# Altium project fullCURRENT control.PrjPCB
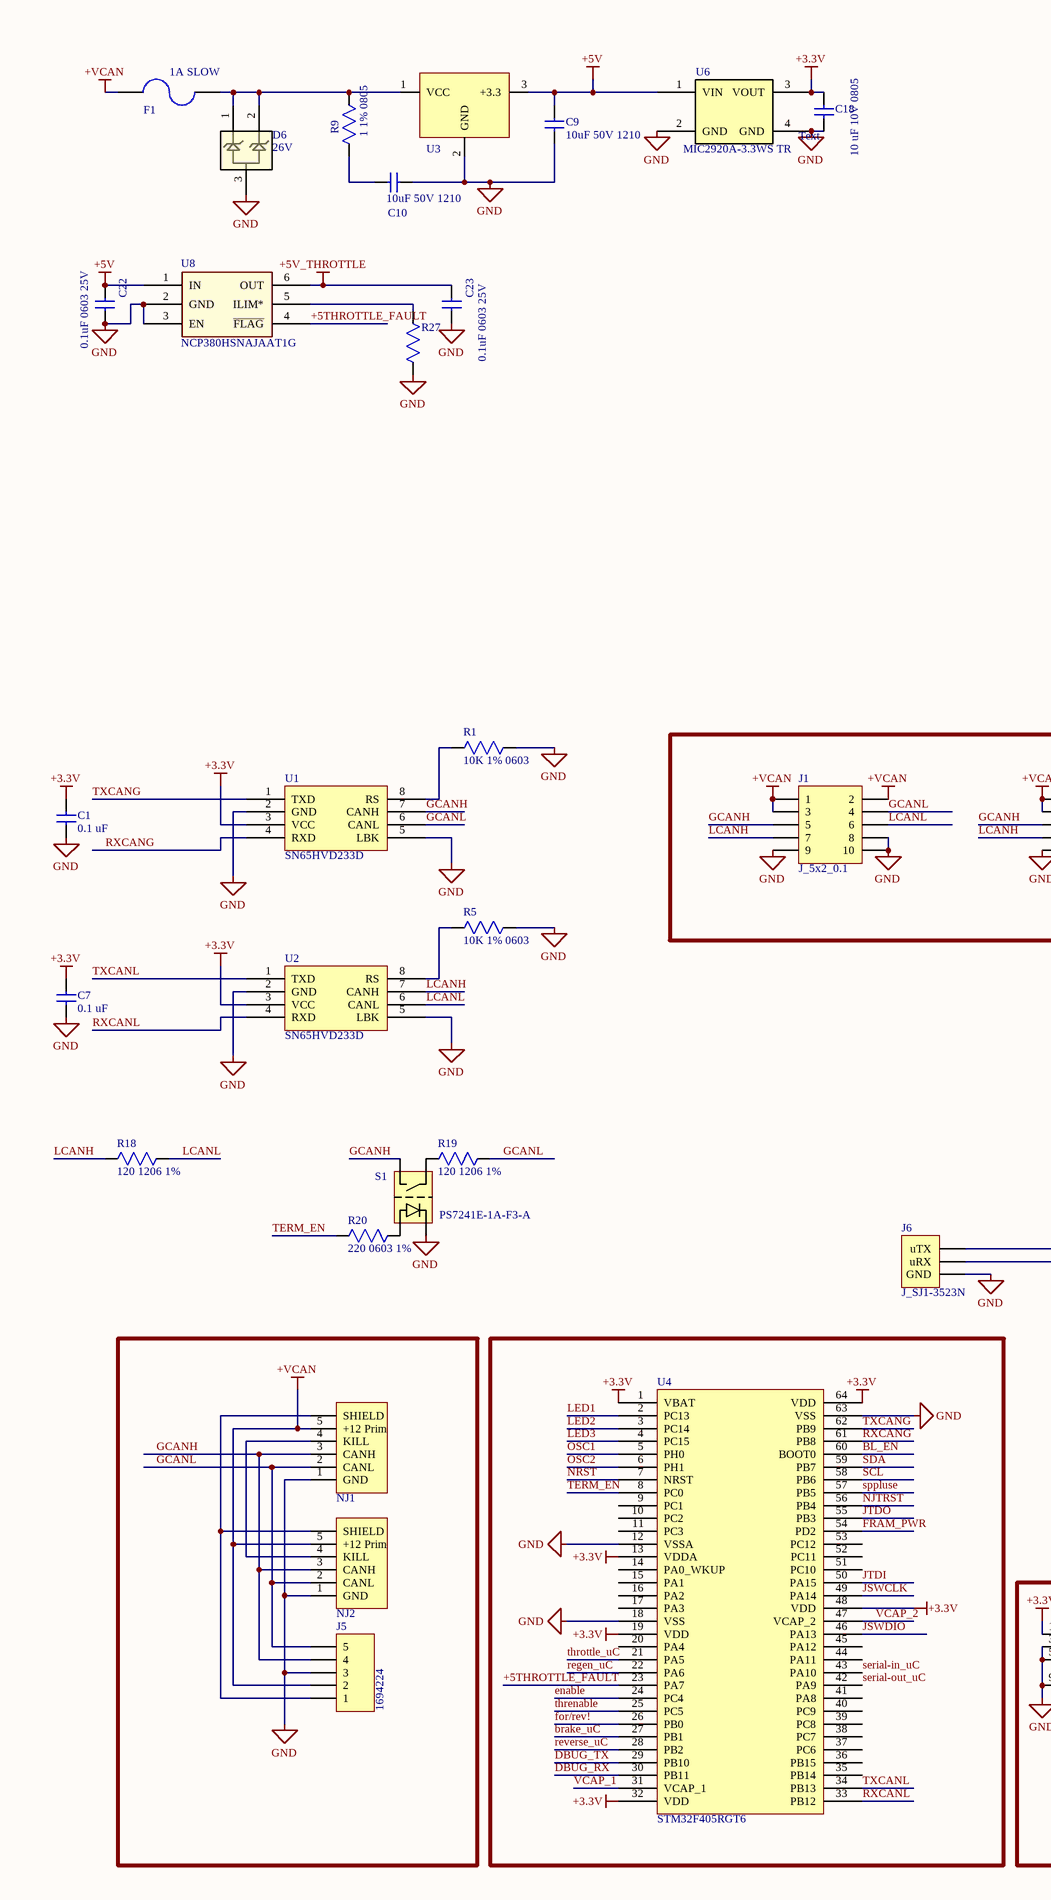
[diagram p0: fullCURRENT control.SchDoc, left]
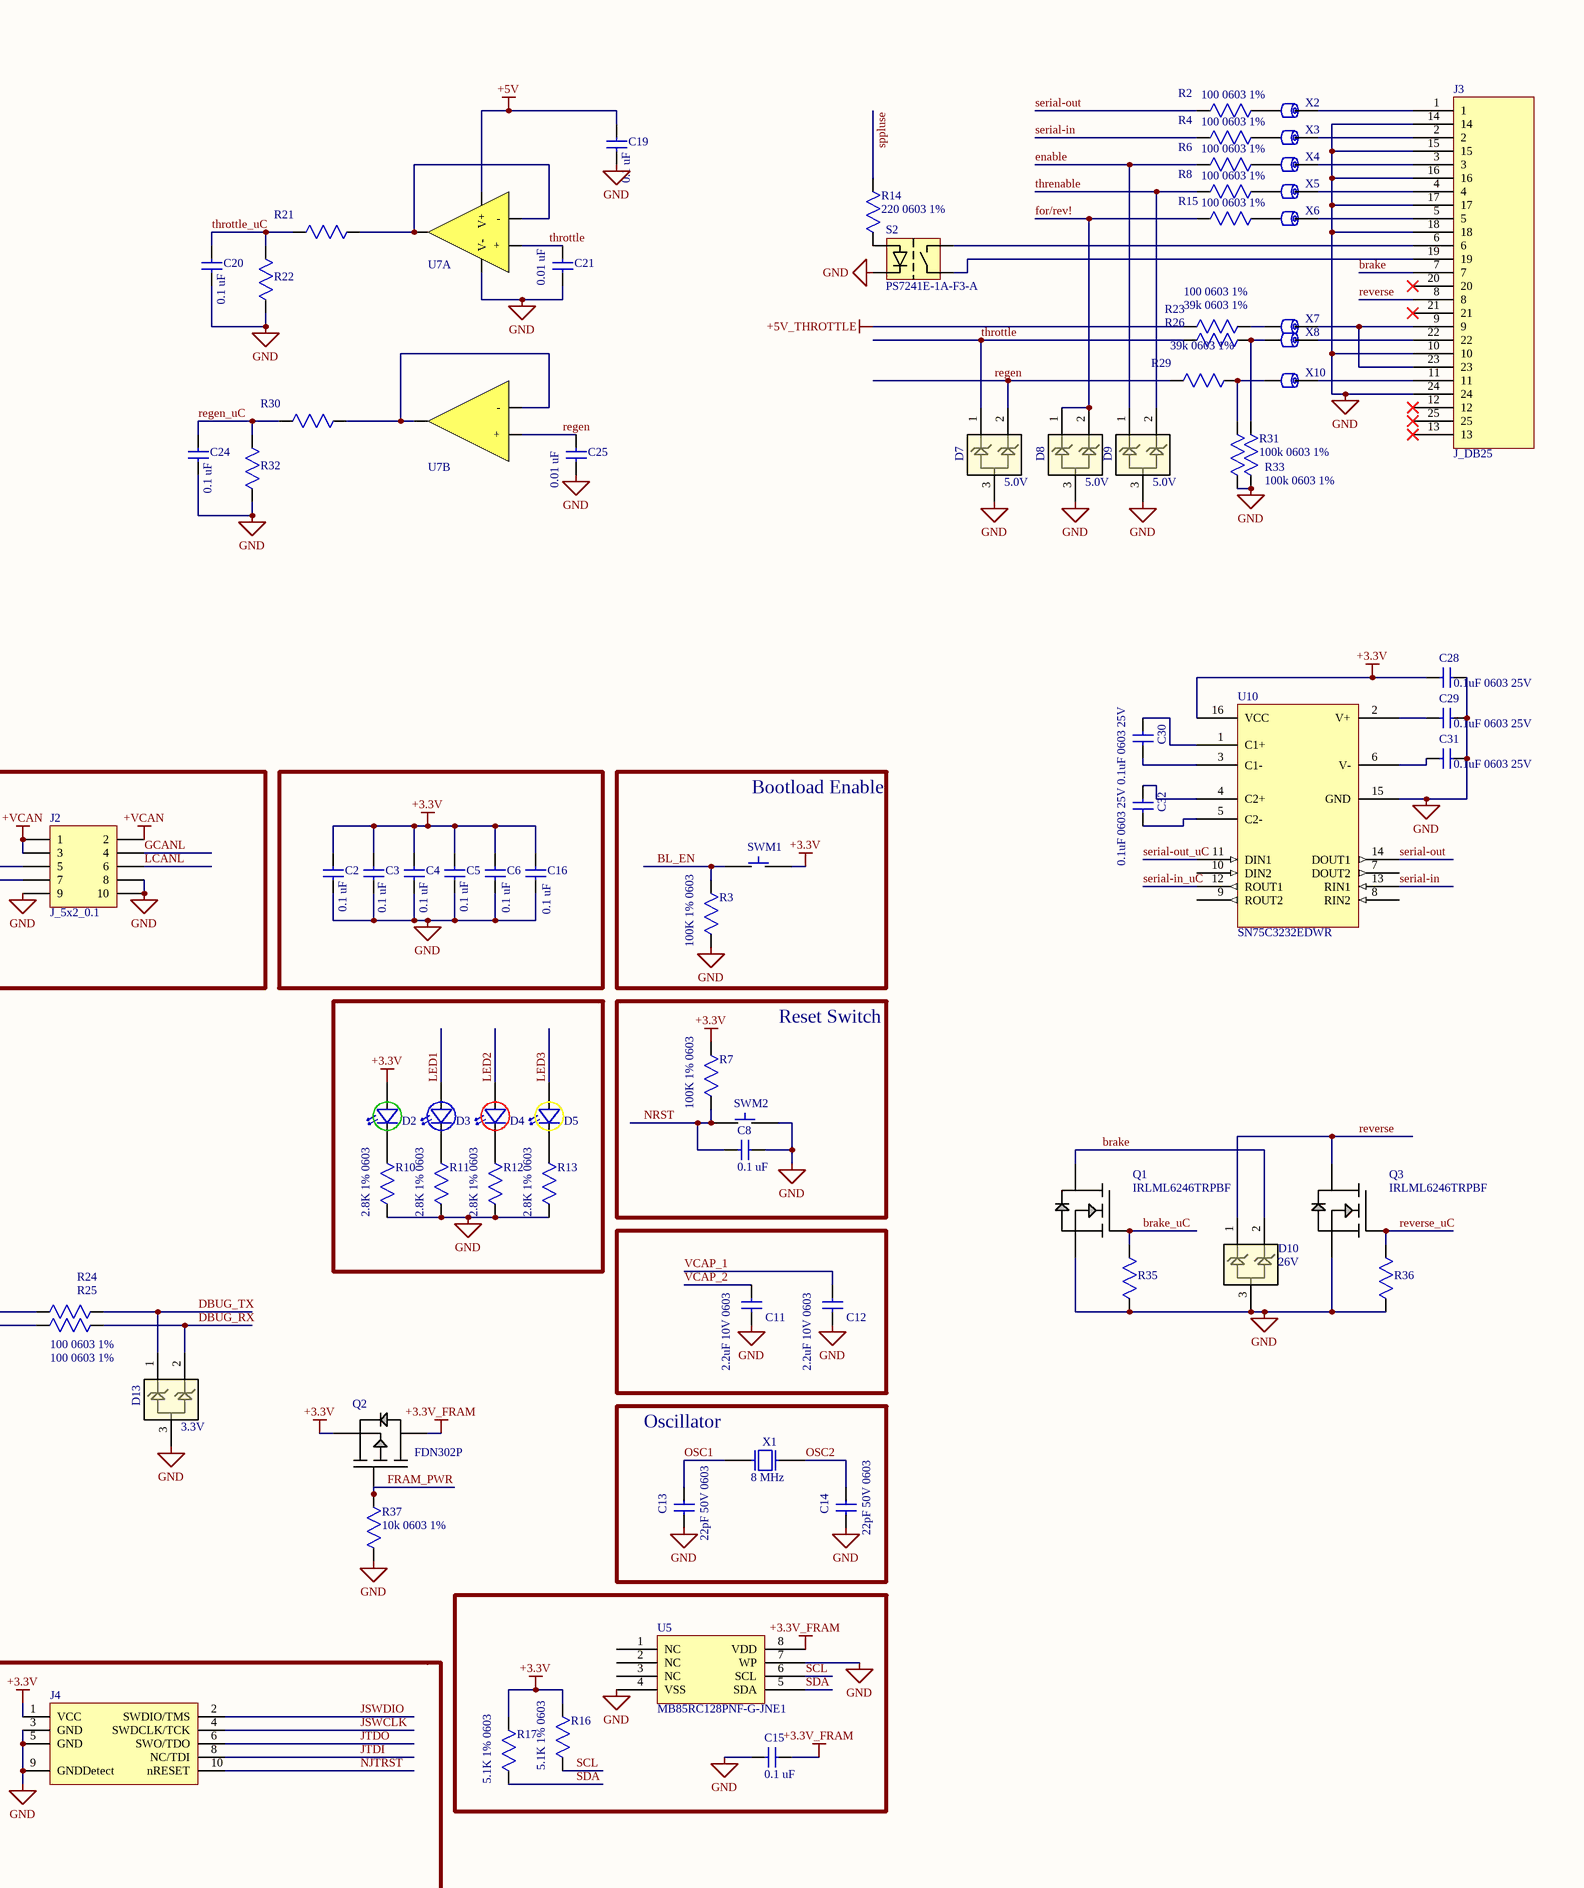
[diagram p1: fullCURRENT control.SchDoc, right]
1 sheet, 108 parts. Net scope: global (net labels, ports and power ports of the same name join across sheets).
Board file: fullCURRENT control.PcbDoc

## Sheet fullCURRENT control.SchDoc
size C

### Parts
C1  value 0.1 uF  [0603_cap]  (hidden comment: CAP 0603)
C2  value 0.1 uF  [0603_cap]  (hidden comment: CAP 0603)
C3  value 0.1 uF  [0603_cap]  (hidden comment: CAP 0603)
C4  value 0.1 uF  [0603_cap]  (hidden comment: CAP 0603)
C5  value 0.1 uF  [0603_cap]  (hidden comment: CAP 0603)
C6  value 0.1 uF  [0603_cap]  (hidden comment: CAP 0603)
C7  value 0.1 uF  [0603_cap]  (hidden comment: CAP 0603)
C8  value 0.1 uF  [0603_cap]  (hidden comment: CAP 0603)
C9  value 10uF 50V 1210  [1210_Capacitor]  (hidden comment: C_1210_10uF)
C10  value 10uF 50V 1210  [1210_Capacitor]  (hidden comment: C_1210_10uF)
C11  value 2.2uF 10V 0603  [0603_cap]  (hidden comment: CAP 0603)
C12  value 2.2uF 10V 0603  [0603_cap]  (hidden comment: CAP 0603)
C13  value 22pF 50V 0603  [0603_cap]  (hidden comment: CAP 0603)
C14  value 22pF 50V 0603  [0603_cap]  (hidden comment: CAP 0603)
C15  value 0.1 uF  [0603_cap]  (hidden comment: CAP 0603)
C16  value 0.1 uF  [0603_cap]  (hidden comment: CAP 0603)
C18  value 10 uF 10V 0805  [0805_Capacitor]  (hidden comment: CAP 0805)
C19  value 0.1 uF  [0603_cap]  (hidden comment: CAP 0603)
C20  value 0.1 uF  [0603_cap]  (hidden comment: CAP 0603)
C21  value 0.01 uF  [0603_cap]  (hidden comment: CAP 0603)
C22  value 0.1uF 0603 25V  [0603_cap]  (hidden comment: CAP 0603)
C23  value 0.1uF 0603 25V  [0603_cap]  (hidden comment: CAP 0603)
C24  value 0.1 uF  [0603_cap]  (hidden comment: CAP 0603)
C25  value 0.01 uF  [0603_cap]  (hidden comment: CAP 0603)
C28  value 0.1uF 0603 25V  [0603_cap]  (hidden comment: CAP 0603)
C29  value 0.1uF 0603 25V  [0603_cap]  (hidden comment: CAP 0603)
C30  value 0.1uF 0603 25V  [0603_cap]  (hidden comment: CAP 0603)
C31  value 0.1uF 0603 25V  [0603_cap]  (hidden comment: CAP 0603)
C32  value 0.1uF 0603 25V  [0603_cap]  (hidden comment: CAP 0603)
D2  3MM GREEN  [LED 3MM GREEN]  (value not drawn)
D3  3MM YELLOW  [LED 3MM BLUE]  (value not drawn)
D4  3MM RED  [LED 3MM RED]  (value not drawn)
D5  3MM YELLOW  [LED 3MM YELLOW]  (value not drawn)
D6  26V  [SOT-23]
D7  5.0V  [SOT-23]
D8  5.0V  [SOT-23]
D9  5.0V  [SOT-23]
D10  26V  [SOT-23]
D13  3.3V  [SOT-23]
F1  Current Rating: 1A SLOW  [2410]  (hidden comment: F_2410)
J1  J_5x2_0.1  [10PIN_2_.100IN]
J2  J_5x2_0.1  [10PIN_2_.100IN]
J3  J_DB25  [DB25]
J4  J_CORTEX_DEBUG  [CORTEX_DEBUG]  (value not drawn)
J5  1694224  [WFSFDH4.5]
J6  J_SJ1-3523N  [SJ1-3523N]
NJ1  NC5FBH_D1  [NC5FBH]  (value not drawn)
NJ2  NC5MBH_D1  [NC5MBH]  (value not drawn)
Q1  Part Number: IRLML6246TRPBF  [SOT-23]  (hidden comment: Q_IRLML6246TRPBF)
Q2  FDN302P  [SOT-23]
Q3  Part Number: IRLML6246TRPBF  [SOT-23]  (hidden comment: Q_IRLML6246TRPBF)
R1  value 10K 1% 0603  [0603_res]  (hidden comment: RES 0603)
R2  value 100 0603 1%  [0603_res]  (hidden comment: RES 0603)
R3  value 100K 1% 0603  [0603_res]  (hidden comment: RES 0603)
R4  value 100 0603 1%  [0603_res]  (hidden comment: RES 0603)
R5  value 10K 1% 0603  [0603_res]  (hidden comment: RES 0603)
R6  value 100 0603 1%  [0603_res]  (hidden comment: RES 0603)
R7  value 100K 1% 0603  [0603_res]  (hidden comment: RES 0603)
R8  value 100 0603 1%  [0603_res]  (hidden comment: RES 0603)
R9  value 1 1% 0805  [0805_Resistor]  (hidden comment: R_0805_1_1%)
R10  value 2.8K 1% 0603  [0603_res]  (hidden comment: RES 0603)
R11  value 2.8K 1% 0603  [0603_res]  (hidden comment: RES 0603)
R12  value 2.8K 1% 0603  [0603_res]  (hidden comment: RES 0603)
R13  value 2.8K 1% 0603  [0603_res]  (hidden comment: RES 0603)
R14  value 220 0603 1%  [0603_res]  (hidden comment: RES 0603)
R15  value 100 0603 1%  [0603_res]  (hidden comment: RES 0603)
R16  value 5.1K 1% 0603  [0603_res]  (hidden comment: RES 0603)
R17  value 5.1K 1% 0603  [0603_res]  (hidden comment: RES 0603)
R18  value 120 1206 1%  [1206_Resistor]  (hidden comment: RES 1206)
R19  value 120 1206 1%  [1206_Resistor]  (hidden comment: RES 1206)
R20  value 220 0603 1%  [0603_res]  (hidden comment: RES 0603)
R21  RES 0603  [0603_res]  (value not drawn)
R22  RES 0603  [0603_res]  (value not drawn)
R23  value 100 0603 1%  [0603_res]  (hidden comment: RES 0603)
R24  value 100 0603 1%  [0603_res]  (hidden comment: RES 0603)
R25  value 100 0603 1%  [0603_res]  (hidden comment: RES 0603)
R26  value 39k 0603 1%  [0603_res]  (hidden comment: RES 0603)
R27  RES 0603  [0603_res]  (value not drawn)
R29  value 39k 0603 1%  [0603_res]  (hidden comment: RES 0603)
R30  RES 0603  [0603_res]  (value not drawn)
R31  value 100k 0603 1%  [0603_res]  (hidden comment: RES 0603)
R32  RES 0603  [0603_res]  (value not drawn)
R33  value 100k 0603 1%  [0603_res]  (hidden comment: RES 0603)
R35  RES 0603  [0603_res]  (value not drawn)
R36  RES 0603  [0603_res]  (value not drawn)
R37  value 10k 0603 1%  [0603_res]  (hidden comment: RES 0603)
S1  Part Number: PS7241E-1A-F3-A  [4SOP-GULL]  (hidden comment: S_PS7241E-1A-F3-A)
S2  Part Number: PS7241E-1A-F3-A  [4SOP-GULL]  (hidden comment: S_PS7241E-1A-F3-A)
SWM1  SW_TACT_SWITCH_6x6  [TACT_SWITCH_6x6]  (value not drawn)
SWM2  SW_TACT_SWITCH_6x6  [TACT_SWITCH_6x6]  (value not drawn)
U1  Part Number: SN65HVD233D  [SOIC127P600X175-8N]  (hidden comment: U_SN65HVD233D)
U2  Part Number: SN65HVD233D  [SOIC127P600X175-8N]  (hidden comment: U_SN65HVD233D)
U3  R-783.3-0.5  [SIP3]  (value not drawn)
U4  STM32F405RGT6  [STM32_LQFP64]
U5  MB85RC128PNF-G-JNE1  [SOIC127P600X175-8N]
U6  Part Number: MIC2920A-3.3WS TR  [SOT-223]  (hidden comment: U_MIC2920A-3.3WS)
U7  IC OP AMP  [SOIC127P600X175-8N]  (value not drawn)  (parts A,B of 2)
U8  NCP380HSNAJAAT1G  [tsop-6]
U10  value SN75C3232EDWR  [SOIC127P600X175-16N]  (hidden comment: U_SN75C3232EDWR)
X1  value 8 MHz  [HC-49]  (hidden comment: HC49)
X2  0603  [0603_res]  (value not drawn)
X3  0603  [0603_res]  (value not drawn)
X4  0603  [0603_res]  (value not drawn)
X5  0603  [0603_res]  (value not drawn)
X6  0603  [0603_res]  (value not drawn)
X7  0603  [0603_res]  (value not drawn)
X8  0603  [0603_res]  (value not drawn)
X10  0603  [0603_res]  (value not drawn)

### Blocks framed on the sheet
Bootload Enable: R3 SWM1
Reset Switch: C8 R7 SWM2
Oscillator: C13 C14 X1

### Nets
+3.3V: C1.1 C2.1 C3.1 C4.1 C5.1 C6.1 C7.1 C16.1 C18.2 C28.1 D2.A(Anode) J4.1(VCC) Q2.2(SOURCE) R7.1 R16.1 R17.1 SWM1.2 U1.3(VCC) U2.3(VCC) U4.1(VBAT) U4.13(VDDA) U4.19(VDD) U4.32(VDD) U4.48(VDD) U4.64(VDD) U6.3(VOUT) U10.16(VCC)
+3.3V_FRAM: C15.2 Q2.3(DRAIN) U5.8(VDD)
+5V: C9.2 C19.1 C22.2 U3.3(+3.3) U6.1(VIN) U7.8(V+) U8.1(IN)
+5V_THROTTLE: C23.2 R23.2 U8.6(OUT)
+VCAN: F1.1 J1.1 J1.2 J1.3 J2.1 J2.2 J2.3 J5.2 NJ1.5(+12_Prim) NJ2.5(+12_Prim)
GND: C1.2 C2.2 C3.2 C4.2 C5.2 C6.2 C7.2 C8.1 C9.1 C10.2 C11.2 C12.2 C13.2 C14.2 C15.1 C16.2 C18.1 C19.2 C20.2 C21.2 C22.1 C23.1 C24.2 C25.2 C28.2 C29.2 C31.2 D6.3 D7.3 D8.3 D9.3 D10.3 D13.3 J1.8 J1.9 J1.10 J2.8 J2.9 J2.10 J3.10 J3.14 J3.15 J3.16 J3.17 J3.18 J3.24 J4.3(GND) J4.5(GND) J4.9(GNDDetect) J5.3 J6.GND NJ1.1(GND) NJ2.1(GND) Q1.2(SOURCE) Q3.2(SOURCE) R1.1 R3.2 R5.1 R10.2 R11.2 R12.2 R13.2 R22.1 R27.1 R31.1 R32.1 R33.1 R35.1 R36.1 R37.2 S1.2 S2.2 SWM2.2 U1.2(GND) U1.5(LBK) U2.2(GND) U2.5(LBK) U3.2(GND) U4.12(VSSA) U4.18(VSS) U4.63(VSS) U5.4(VSS) U5.7(WP) U6.2(GND) U6.4(GND) U7.4(V-) U8.2(GND) U8.3(EN) U10.15(GND)
+5THROTTLE_FAULT: U4.23(PA7) U8.4(~{FLAG})
BL_EN: R3.1 SWM1.1 U4.60(BOOT0)
brake: D10.2 J3.7 Q1.3(DRAIN)
brake_uC: Q1.1(GATE) R35.2 U4.27(PB1)
DBUG_RX: D13.2 R25.2 U4.30(PB11)
DBUG_TX: D13.1 R24.2 U4.29(PB10)
enable: D9.1 R6.2 U4.24(PC4)
for/rev!: D8.1 D8.2 R15.2 U4.26(PB0)
FRAM_PWR: Q2.1(GATE) R37.1 U4.54(PD2)
GCANH: J1.5 J2.5 J5.4 NJ1.3(CANH) NJ2.3(CANH) S1.4 U1.7(CANH)
GCANL: J1.4 J2.4 J5.5 NJ1.2(CANL) NJ2.2(CANL) R19.2 U1.6(CANL)
JSWCLK: J4.4(SWDCLK/TCK) U4.49(PA14)
JSWDIO: J4.2(SWDIO/TMS) U4.46(PA13)
JTDI: J4.8(NC/TDI) U4.50(PA15)
JTDO: J4.6(SWO/TDO) U4.55(PB3)
LCANH: J1.7 J2.7 R18.1 U2.7(CANH)
LCANL: J1.6 J2.6 R18.2 U2.6(CANL)
LED1: D3.A(Anode) U4.2(PC13)
LED2: D4.A(Anode) U4.3(PC14)
LED3: D5.A(Anode) U4.4(PC15)
NJTRST: J4.10(nRESET) U4.56(PB4)
NRST: C8.2 R7.2 SWM2.1 U4.7(NRST)
OSC1: C13.1 U4.5(PH0) X1.1
OSC2: C14.1 U4.6(PH1) X1.2
regen: C25.1 D7.2 R29.2 U7.5(+)
regen_uC: C24.1 R30.2 R32.2 U4.22(PA6)
reverse: D10.1 J3.8 Q3.3(DRAIN)
reverse_uC: Q3.1(GATE) R36.2 U4.28(PB2)
RXCANG: U1.4(RXD) U4.61(PB8)
RXCANL: U2.4(RXD) U4.33(PB12)
SCL: R16.2 U4.58(PB6) U5.6(SCL)
SDA: R17.2 U4.59(PB7) U5.5(SDA)
serial-in: R4.2 U10.13(RIN1)
serial-in_uC: U4.43(PA10) U10.12(ROUT1)
serial-out: R2.2 U10.14(DOUT1)
serial-out_uC: U4.42(PA9) U10.11(DIN1)
sppluse: R14.2 U4.57(PB5)
TERM_EN: R20.2 U4.8(PC0)
threnable: D9.2 R8.2 U4.25(PC5)
throttle: C21.1 D7.1 R26.2 U7.3(+)
throttle_uC: C20.1 R21.2 R22.2 U4.21(PA5)
TXCANG: U1.1(TXD) U4.62(PB9)
TXCANL: U2.1(TXD) U4.34(PB13)
VCAP_1: C12.1 U4.31(VCAP_1)
VCAP_2: C11.1 U4.47(VCAP_2)
NetC10_1: C10.1 R9.2
NetC29_1: C29.1 U10.2(V+)
NetC30_1: C30.1 U10.3(C1-)
NetC30_2: C30.2 U10.1(C1+)
NetC31_1: C31.1 U10.6(V-)
NetC32_1: C32.1 U10.5(C2-)
NetC32_2: C32.2 U10.4(C2+)
NetD2_K: D2.K(Cathode) R10.1
NetD3_K: D3.K(Cathode) R11.1
NetD4_K: D4.K(Cathode) R12.1
NetD5_K: D5.K(Cathode) R13.1
NetD6_1: D6.1 D6.2 F1.2 R9.1 U3.1(VCC)
NetJ3_1: J3.1 X2.2
NetJ3_2: J3.2 X3.2
NetJ3_3: J3.3 X4.2
NetJ3_4: J3.4 X5.2
NetJ3_5: J3.5 X6.2
NetJ3_6: J3.6 S2.4
NetJ3_9: J3.9 J3.23 X7.2
NetJ3_11: J3.11 X10.2
NetJ3_19: J3.19 S2.3
NetJ3_22: J3.22 X8.2
NetJ5_1: J5.1 NJ1.6(SHIELD) NJ2.6(SHIELD)
NetJ6_uRX: J6.uRX R25.1
NetJ6_uTX: J6.uTX R24.1
NetNJ1_4: NJ1.4(KILL) NJ2.4(KILL)
NetR1_2: R1.2 U1.8(RS)
NetR2_1: R2.1 X2.1
NetR4_1: R4.1 X3.1
NetR5_2: R5.2 U2.8(RS)
NetR6_1: R6.1 X4.1
NetR8_1: R8.1 X5.1
NetR14_1: R14.1 S2.1
NetR15_1: R15.1 X6.1
NetR19_1: R19.1 S1.3
NetR20_1: R20.1 S1.1
NetR21_1: R21.1 U7.1(Vo) U7.2(-)
NetR23_1: R23.1 X7.1
NetR26_1: R26.1 R31.2 X8.1
NetR27_2: R27.2 U8.5(ILIM*)
NetR29_1: R29.1 R33.2 X10.1
NetR30_1: R30.1 U7.6(-) U7.7(Vo)

Not connected (* = marked no-connect by the designer): J3 12* 13* 20* 21* 25*; U4 9(PC1) 10(PC2) 11(PC3) 14(PA0_WKUP) 15(PA1) 16(PA2) 17(PA3) 20(PA4) 35(PB14) 36(PB15) 37(PC6) 38(PC7) 39(PC8) 40(PC9) 41(PA8) 44(PA11) 45(PA12) 51(PC10) 52(PC11) 53(PC12); U5 1(NC) 2(NC) 3(NC); U10 7(DOUT2) 8(RIN2) 9(ROUT2) 10(DIN2)

### Notes on the sheet
- (near C18) Text

### Library data of the parts
C1-C8 C15 C16 C19 C20 C24 = C_0603: CAP CERM 0.1uF 0603 X7R; Manufacturer: Murata; Part Number: GRM188R71E104KA01D; Package: 0603; Supplier 1: Digi-Key; Supplier Part Number 1: 490-1524-1-ND
C9 C10 = C_1210_10uF: CAP CER 10UF 50V 10% X5R 1210; Manufacturer: Taiyo Yuden; Part Number: UMK325AB7106MM-T; Package: 1210; Supplier 1: Digi-Key; Supplier Part Number 1: 587-3166-1-ND
C11 C12 = C_0603: CAP CER 2.2UF 10V 10% X7R 0603; Manufacturer: Taiyo Yuden; Part Number: LMK107B7225KA-T; Supplier 1: Digi-Key; Supplier Part Number 1: 587-2983-1-ND
C13 C14 = C_0603: CAP CER 22PF 50V 5% NPO 0603; Manufacturer: Yageo; Part Number: CC0603JRNPO9BN200; Supplier 1: Digi-Key; Supplier Part Number 1: 445-1273-1-ND
C18 = C_0805: CAP CERM 0805; Supplier 1: Digi-Key; Supplier Part Number 1: 587-1300-1-ND
C21 C25 = C_0603: CAP CERM 0.01uF 0603 X7R; Manufacturer: Murata; Package: 0603; Supplier 1: Digi-Key
C22 C23 C28-C32 = C_0603: CAP CERM 0.1uF 0603 X7R; Supplier 1: Digi-Key; Supplier Part Number 1: 490-1524-1-ND
D2 = D_LED 3MM GREEN: LED 3MM GREEN; Supplier 1: Digi-Key; Supplier Part Number 1: 365-1174-ND
D3 = D_LED 3MM BLUE: LED 3MM BLUE; Supplier 1: Digi-Key; Supplier Part Number 1: 365-1173-ND
D4 = D_LED 3MM RED: LED 3MM RED; Supplier 1: Digi-Key; Supplier Part Number 1: 365-1175-ND
D5 = D_LED 3MM YELLOW: LED 3MM YELLOW; Supplier 1: Digi-Key; Supplier Part Number 1: 365-1176-ND
D6 D10 = D_TVS_12V: Supplier 1: Digi-Key; Supplier Part Number 1: MMBZ33VAL-FDICT-ND
D7-D9 = D_TVS_5: 5.0V TVS SOT23; Supplier 1: Digi-Key; Supplier Part Number 1: 641-1198-1-ND
D13 = D_TVS_5: 3.3V TVS SOT23; Supplier 1: Digi-Key
F1 = F_2410: FUSE 2410; Package: 2410; Supplier 1: Digi-Key; Supplier Part Number 1: 507-1186-1-ND
J1 J2 = J_5x2_0.1: 5 x 2 0.1" Header; Supplier 1: Digi-Key; Supplier Part Number 1: S9169-ND
J4 = J_CORTEX_DEBUG: CORTEX JTAG DEBUG CONNECTOR; Part Number: FTSH-105-01-F-D; Manufacturer: Samtec; Supplier 1: Samtec; Supplier Part Number 1: FTSH-105-01-F-D
J5 = Header 5: CONNECTOR, 5-pos., M12, A-coded; Manufacturer: PHOENIX CONTACT/EQUIV.; Part Number: 1694224; Supplier 1: Digi-Key; Supplier Part Number 1: 277-2689-ND
J6 = J_SJ1-3523N: CONN JACK STEREO R/A 3PIN 3.5MM; Manufacturer: CUI; Part Number: SJ1-3523N
NJ1 = NC5FBH_D1: D1 Bus Connector; Manufacturer: Neutrik; Part Number: NC5FBH; Supplier 1: Mouser; Supplier Part Number 1: 568-NC5MBH-B
NJ2 = NC5MBH_D1: D1 Bus Connector; Manufacturer: Neutrik; Part Number: NC5MBH; Supplier 1: Mouser; Supplier Part Number 1: 568-NC5MBH-B
Q1 Q3 = Q_IRLML6246TRPBF: MOSFET N-CH 20V 4.1A SOT-23; Manufacturer: Alpha & Omega
Q2 = Q_FDN302P: MOSFET P-CH 20V 2.4A SSOT3; Manufacturer: Fairchild Semiconductor; SVP Creator: Adam Shea; SVP Reviewer 1: Nate Bolyard; SVP Reviewer 2: Trevtron; Package: SOT-23; Known Distributors: Digikey, Newark; Manufacturer PN: FDN302P; ComponentLink1URL: http://umnsvp.dyndns.org/svn/centaurus2/datasheets/Common Board/FDN302P.pdf; ComponentLink1Description: Datasheet; HelpURL: http://umnsvp.dyndns.org/svn/centaurus2/datasheets/Common Board/FDN302P.pdf; Value: FDN302P
R1 R5 = R_0603: RES 10K 1% 0603; Package: 0603; Supplier 1: Digi-Key; Supplier Part Number 1: 311-10.0KHRCT-ND
R2 R4 R6 R8 R15 R23-R26 R29 = R_0603: RES 100 0603 1%; Supplier 1: Digi-Key
  R2 R4 R6 R8 R15 R23 R26 R29: Supplier Part Number 1: 311-100HRCT-ND
R3 R7 = R_0603: RES 100K 1% 0603; Package: 0603; Supplier 1: Digi-Key; Supplier Part Number 1: 311-100KHRCT-ND
R9 = R_0805_1_1%: RES 1 OHM 1/8W 1% 0805 SMD; Power Rating: .125W; Package: 0805; Supplier 1: Digi-Key; Supplier Part Number 1: RHM1.00CICT-ND
R10-R13 = R_0603: RES 300 1% 0603; Package: 0603
R14 R20 = R_0603: RES 220 0603 1%; Manufacturer: Yageo; Part Number: RC0603FR-07220RL; Package: 0603; Supplier 1: Digi-Key; Supplier Part Number 1: 311-220GRCT-ND
R16 R17 = R_0603: RES 5.1K 1% 0603; Package: 0603; Supplier 1: Digi-Key; Supplier Part Number 1: 311-5.10KCRCT-ND
R18 R19 = R_1206: RES 120 1206 1%; Package: 1206; Supplier 1: Digi-Key; Supplier Part Number 1: 311-120FRCT-ND
R21 R22 R27 R30 R32 R35 R36 = R_0603
  R21 R22 R30 R32 R35 R36: Supplier 1: Digi-Key
  R27: Known Distributors: Digikey; Package: 0603
R31 R33 = R_0603: RES 100k 0603 1%; Supplier 1: Digi-Key; Supplier Part Number 1: 311-100HRCT-ND
R37 = R_0603: RES 10K 0603 1%; Supplier 1: Digi-Key; Supplier Part Number 1: 311-10.0KHRCT-ND
S1 S2 = S_PS7241E-1A-F3-A: SSR OCMOS FET 120MA 1CH NO 4-SOP; Manufacturer: CEL; Supplier 1: Digi-Key; Supplier Part Number 1: PS7241E-1ACT-ND
SWM1 SWM2 = SW_TACT_SWITCH_6x6: SWITCH TACTILE SPST-NO 0.05A 12V; Manufacturer: C&K Components; Part Number: PTS645SK43 LFS; Supplier 1: Digi-Key; Supplier Part Number 1: CKN9090-ND
U1 U2 = U_SN65HVD233D: IC 3.3V CAN TXRX 8-SOIC; Manufacturer: Texas Instruments; Supplier 1: Digi-Key; Supplier Part Number 1: 296-14639-5-ND
U3 = U_R-783.3-0.5: IC REG 0.5A 3.3V; Manufacturer: Recom Power; Part Number: R-783.3-0.5; Supplier 1: Digi-Key; Supplier Part Number 1: 945-1035-ND
U4 = U_STM32F405RGT6: IC MCU 32BIT 1MB FLASH 64LQFP; Manufacturer: STMicroelectronics; Part Number: STM32F405RGT6; Supplier 1: Digi-Key; Supplier Part Number 1: 497-11767-ND
U5 = U_MB85RC16PNF-G-JNE1: IC FRAM 128KBIT 400KHZ 8SOP; Manufacturer: Fujitsu Semiconductor America Inc; Package: SOIC-8; Part Number: MB85RC128PNF-G-JNE1; Supplier 1: Digi-Key; Supplier Part Number 1: 865-1172-ND
U6 = U_MIC2920A-3.3WS: IC REG LDO 3.3V .4A SOT223; Manufacturer: Mircrel; Supplier 1: Digi-Key; Supplier Part Number 1: 576-1116-1-ND
U7 = U_MCP6042T-I/SN: IC OPAMP 1UA 1.4V DUAL R-R 8SOIC; Manufacturer: Microchip; SVP Creator: Jonathan Nutzmann; Package: 8-SOIC; Known Distributors: Digikey; Manufacturer PN: MCP6042T-I/SN; ComponentLink1Description: Datasheet; ComponentLink1URL: SVN Datasheet URL; Price: 0.97
U8 = U_NCP380HSNAJAAT1G: IC CURRENT LIMIT SWITCH 6-TSOP; Manufacturer: ON Semiconductor; Part Number: NCP380HSNAJAAT1G; Supplier 1: Digi-Key; Supplier Part Number 1: NCP380HSNAJAAT1GOSCT-ND
U10 = U_SN75C3232EDWR: IC LINE DRVR/RCVR RS232 16-SOIC; Manufacturer: TI; Manufacturer PN: TRS3232EIDR; SVP Creator: Jonathan Nutzmann; Known Distributors: Digikey; ComponentLink1Description: Datasheet
X1 = X_HC49: CRYSTAL 8.0 MHZ 20PF; Part Number: FOXSLF/080-20; Manufacturer: Fox Electronics; Supplier 1: Digi-Key; Supplier Part Number 1: 631-1100-ND
X2-X8 X10 = X_0603_FERRITE: FERRITE 0603; Supplier 1: Digi-Key; Supplier Part Number 1: 445-2205-2-ND